# EAGLE design 555_module_throu (EAGLE 7.1.0)
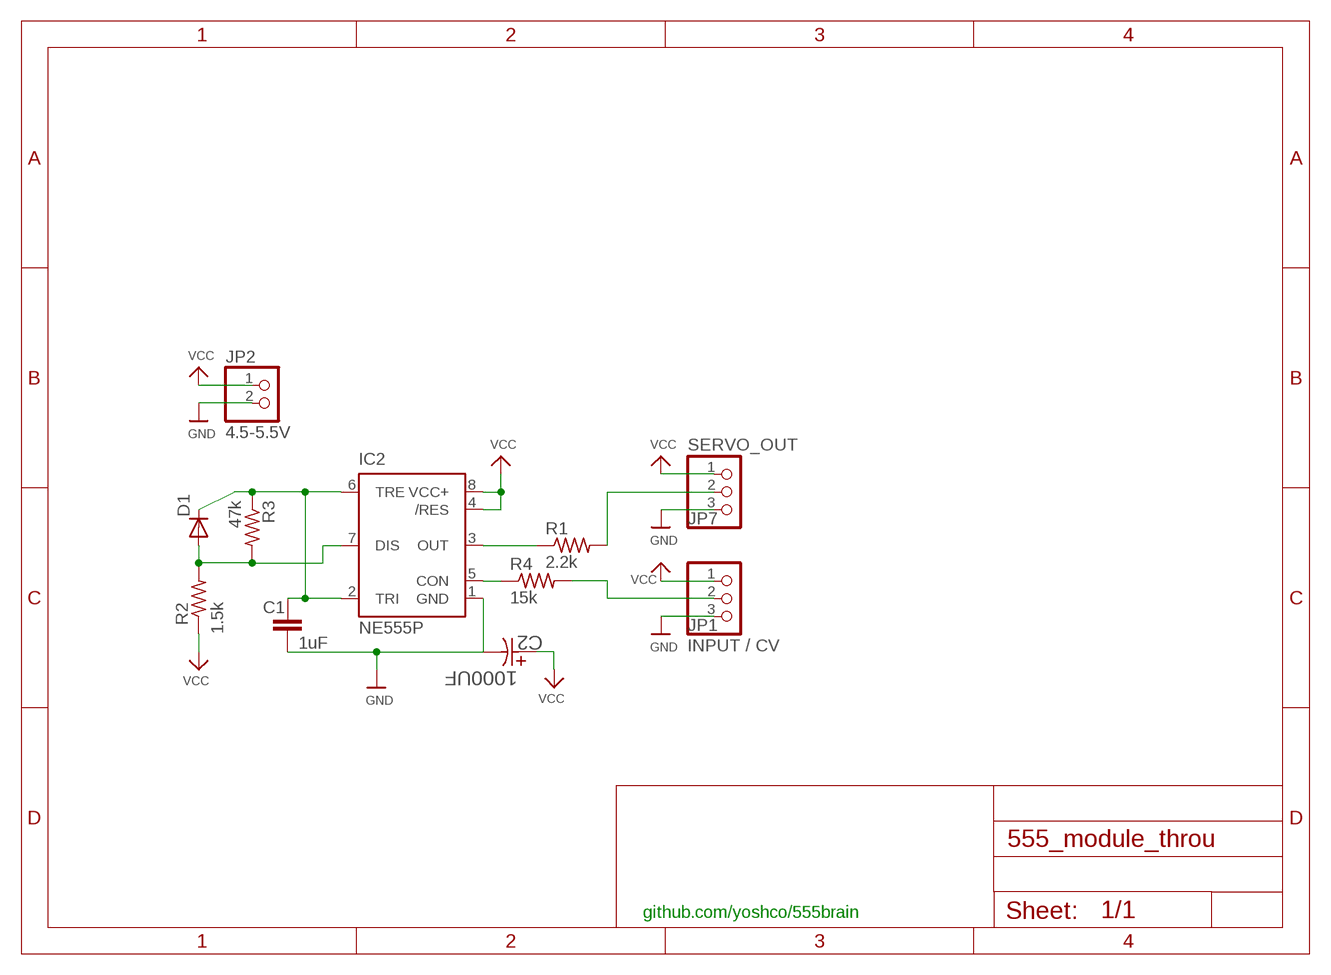
[diagram p0: schematic, sheet 1]

## Parts
C1  1uF  CAP_  [AXIAL-5MM]
C2  1000UF  EEUFK0J102-P5.0  [CAPPR500-1000X3200]
D1  1N4004  [DO41-10]
IC2  NE555P  [DIL-08]
JP1  INPUT / CV  PINHD-1X3  [1X03]
JP2  4.5-5.5V  HEADER-1X2  [1X02_OVAL]
JP7  SERVO_OUT  PINHD-1X3  [1X03]
R1  2.2k  R-US_0204/7  [0204/7]
R2  1.5k  R-US_0204/7  [0204/7]
R3  47k  R-US_0204/7  [0204/7]
R4  15k  R-US_0204/7  [0204/7]

## Nets
GND: C1.P$2 C2.2 IC2.1(GND) JP1.3 JP2.2 JP7.3
INPUT: JP1.2 R4.2
N$1: C1.P$1 D1.C IC2.2(TRI) IC2.6(TRE) R3.1
N$2: D1.A IC2.7(DIS) R2.2 R3.2
N$4: IC2.5(CON) R4.1
N$5: IC2.3(OUT) R1.1
SERVO_OUT: JP7.2 R1.2
VCC: C2.1 IC2.4(/RES) IC2.8(VCC+) JP1.1 JP2.1 JP7.1 R2.1

## Notes on the sheet
- github.com/yoshco/555brain

## Library data of the parts
C1 = SparkFun-Capacitors:CAP: Capacitor Standard 0603 ceramic capacitor, and 0.1" leaded capacitor.
C2 = Panasonic-EE4:EEU: Aluminum Electrolytic Capacitors; MPN: EEUFK0J102; OC_FARNELL: 1744869; OC_NEWARK: Unknown; RATEDVOLTAGE: 6.3 V; SUPPLIER: PANASONIC; TOLERANCE: ±20 %
D1 = adafruit:1N4004: DIODE General purpose 1N400x type rectifier (With bigger pads) http://www.ladyada.net/library/pcb/eaglelibrary.html
IC2 = SparkFun-AnalogIC:NE555: General purpose bipolar Timer; MF: Arrow Electronics; MPN: NE555N; OC_FARNELL: 1467742; OC_NEWARK: 89K1486
JP1 JP7 = adafruit:PINHD-1X3: PIN HEADER
JP2 = microbuilder:HEADER-1X2: PIN HEADER
R1-R4 = adafruit:R-US_: RESISTOR, American symbol

## Board
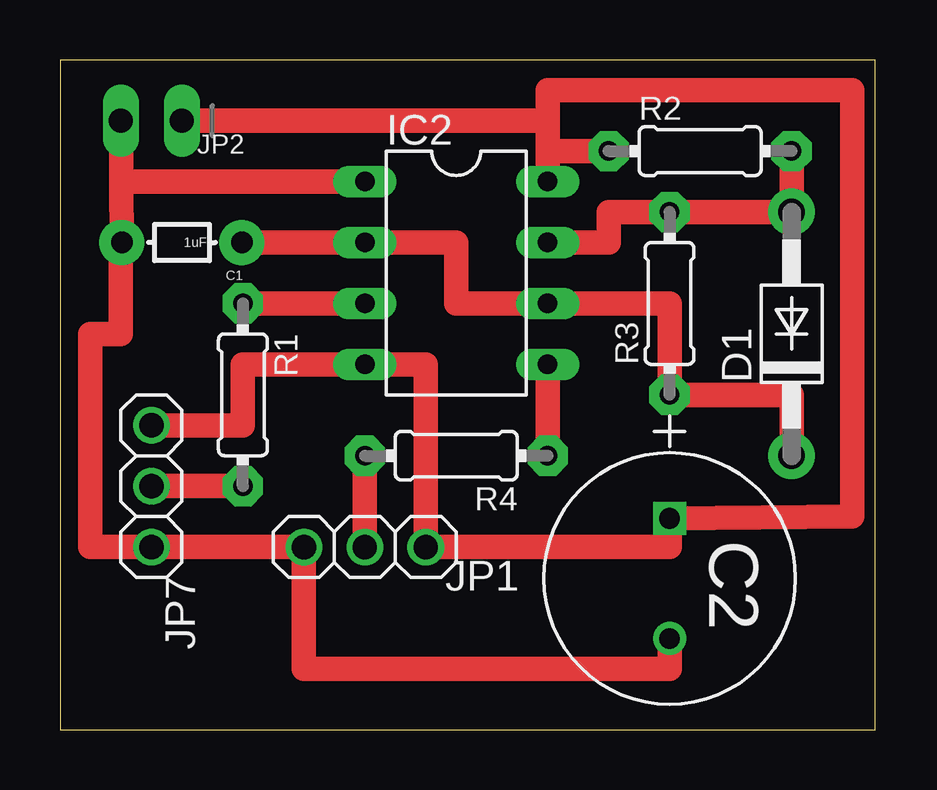
[diagram p1: board, top side]

Size 33.96 x 27.93 mm. Coordinates in mm from the lower left corner, seen from the top.
Outline: 0,0 33.96,0 33.96,27.93 0,27.93 0,0
Copper layers (1*16): Top 0.035mm / dielectric 1.5mm / Bottom 0.035mm
Design rules "default": minimum track width 10mil, minimum drill 0.6mm, track to track 8mil, track to pad 8mil, pad to pad 8mil, via to via 8mil, smd to smd 8mil, copper to edge 40mil, drill to drill 8mil, minimum pad ring 10mil, minimum via ring 8mil, stop-mask expansion 4mil, vias tented up to drill 0mil, thermal gap 10mil

### Footprints (pad centres in the part's own frame; a part is rotated, then mirrored left to right if it is on the bottom)
AXIAL-5MM = drill 0.9 pad 1.88: P$1 -2.5,0; P$2 2.5,0
CAPPR500-1000X3200 = drill 0.864 square: 1 -5.004,0 | drill 0.864: 2 0,0
DO41-10 = drill 1.118 pad 1.93: A 5.08,0; C -5.08,0
DIL-08 = drill 0.813 long: 1 -3.81,-3.81; 2 -1.27,-3.81; 3 1.27,-3.81; 4 3.81,-3.81; 5 3.81,3.81; 6 1.27,3.81; 7 -1.27,3.81; 8 -3.81,3.81
1X03 = drill 1.016: 1 -2.54,0; 2 0,0; 3 2.54,0
1X02_OVAL = drill 1 long: 1 -1.27,0; 2 1.27,0
0204/7 = drill 0.813 pad 1.676 octagon: 1 -3.81,0; 2 3.81,0

### Placement (x,y rotation side)
C1  5.08,20.32 180 top
C2  25.4,3.81 270 top
D1  30.48,16.51 90 top
IC2  16.51,19.05 270 top
JP1  12.7,7.62 180 top
JP2  3.81,25.4 180 top
JP7  3.81,10.16 270 top
R1  7.62,13.97 270 top
R2  26.67,24.13 0 top
R3  25.4,17.78 90 top
R4  16.51,11.43 180 top

### Tracks (layer width: path | path; a pad name or v marks a point on that pad's centre or on a via)
GND
  Top 1.016: JP2.2 2.56,22.85 | 2.56,22.85 C1.P$2 2.54,20.32 2.54,16.51 1.27,16.51 1.27,7.62 JP7.3 JP1.3 10.16,2.54 25.4,2.54 C2.2 | IC2.1 2.56,22.85
INPUT
  Top 1.016: R4.2 JP1.2
N$1
  Top 1.016: C1.P$1 IC2.2 16.51,20.32 16.51,17.78 IC2.6 25.4,17.78 R3.1 30.48,13.97 D1.C
N$2
  Top 1.016: IC2.7 22.86,20.32 22.86,21.59 R3.2 D1.A R2.2
N$4
  Top 1.016: IC2.5 R4.1
N$5
  Top 1.016: IC2.3 R1.1
SERVO_OUT
  Top 1.016: JP7.2 R1.2
VCC
  Top 1.016: JP7.1 7.62,12.7 7.62,15.24 IC2.4 15.24,15.24 JP1.1 25.4,7.62 C2.1 33.02,8.89 33.02,26.67 20.32,26.67 20.32,25.4 | 20.32,25.4 20.32,24.13 | 20.32,24.13 IC2.8 | JP2.1 20.32,25.4 | R2.1 20.32,24.13